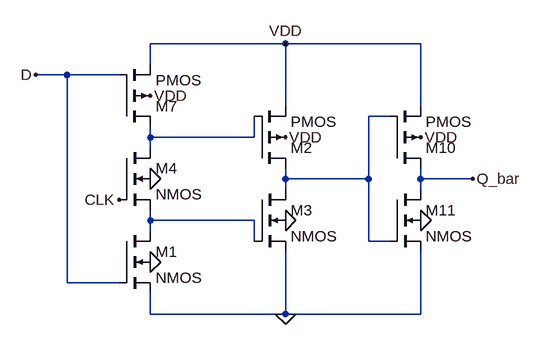
[diagram p0: schematic DFF2.asc]
DFF2.asc, the LTspice schematic file:
Version 4
SHEET 1 900 680
WIRE 400 -192 192 -192
WIRE 608 -192 400 -192
WIRE 192 -160 192 -192
WIRE 64 -144 16 -144
WIRE 144 -144 64 -144
WIRE 400 -96 400 -192
WIRE 608 -96 608 -192
WIRE 560 -80 528 -80
WIRE 192 -48 192 -64
WIRE 352 -48 352 -80
WIRE 352 -48 192 -48
WIRE 192 -32 192 -48
WIRE 400 16 400 0
WIRE 528 16 528 -80
WIRE 528 16 400 16
WIRE 608 16 608 0
WIRE 688 16 608 16
WIRE 400 32 400 16
WIRE 608 32 608 16
WIRE 192 80 192 64
WIRE 352 80 192 80
WIRE 192 96 192 80
WIRE 352 112 352 80
WIRE 528 112 528 16
WIRE 560 112 528 112
WIRE 64 176 64 -144
WIRE 144 176 64 176
WIRE 192 224 192 192
WIRE 400 224 400 128
WIRE 400 224 192 224
WIRE 608 224 608 128
WIRE 608 224 400 224
FLAG 400 -192 VDD
FLAG 144 48 CLK
FLAG 400 224 0
FLAG 16 -144 D
FLAG 688 16 Q_bar
FLAG 192 144 0
FLAG 608 80 0
FLAG 192 -112 VDD
FLAG 400 80 0
FLAG 608 -48 VDD
FLAG 400 -48 VDD
FLAG 192 16 0
SYMBOL nmos4 144 96 R0
SYMATTR InstName M1
SYMBOL pmos4 144 -64 M180
SYMATTR InstName M7
SYMBOL pmos4 560 0 M180
SYMATTR InstName M10
SYMBOL nmos4 560 32 R0
SYMATTR InstName M11
SYMBOL pmos4 352 0 M180
SYMATTR InstName M2
SYMBOL nmos4 352 32 R0
SYMATTR InstName M3
SYMBOL nmos4 144 -32 R0
SYMATTR InstName M4

The netlist it stands for:
* DFF2.asc
M1 N003 D 0 0 NMOS
M7 N002 D VDD VDD PMOS
M10 Q_bar N001 VDD VDD PMOS
M11 Q_bar N001 0 0 NMOS
M2 N001 N002 VDD VDD PMOS
M3 N001 N003 0 0 NMOS
M4 N002 CLK N003 0 NMOS
.model NMOS NMOS
.model PMOS PMOS
.lib standard.mos
.backanno
.end